# Altium schematic sheet top.SchDoc
size A4
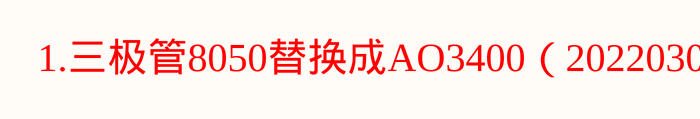
[diagram p0: top.SchDoc]

## Notes on the sheet
- 1.三极管8050替换成AO3400（20220303）